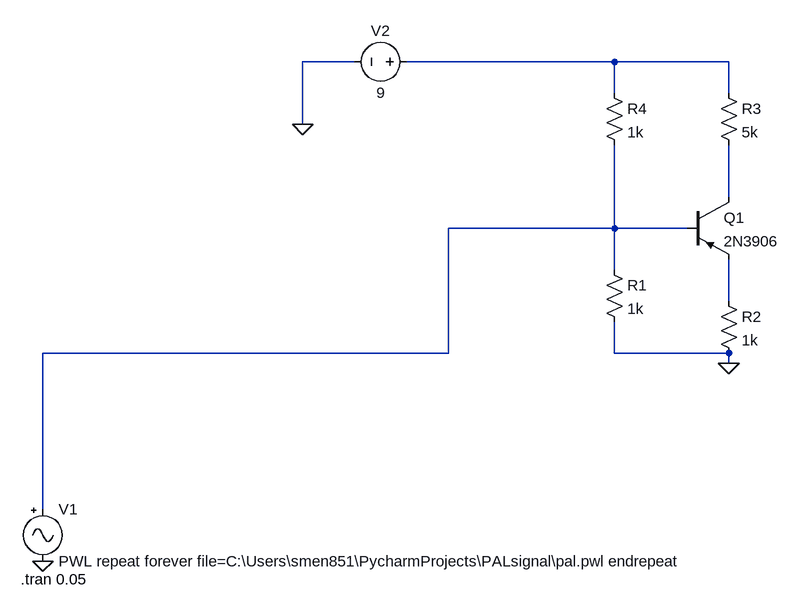
[diagram p0: schematic ltspicesym.asc]
ltspicesym.asc, the LTspice schematic file:
Version 4
SHEET 1 1300 680
WIRE 560 -560 480 -560
WIRE 960 -560 640 -560
WIRE 1136 -560 960 -560
WIRE 960 -512 960 -560
WIRE 1136 -512 1136 -560
WIRE 480 -464 480 -560
WIRE 1136 -352 1136 -432
WIRE 960 -304 960 -432
WIRE 960 -304 704 -304
WIRE 1072 -304 960 -304
WIRE 960 -240 960 -304
WIRE 1136 -192 1136 -256
WIRE 704 -112 704 -304
WIRE 704 -112 80 -112
WIRE 960 -112 960 -160
WIRE 1136 -112 960 -112
WIRE 1136 -96 1136 -112
WIRE 80 128 80 -112
FLAG 80 208 0
FLAG 480 -464 0
FLAG 1136 -96 0
SYMBOL Misc\\signal 80 112 R0
WINDOW 123 0 0 Left 0
WINDOW 39 0 0 Left 0
SYMATTR InstName V1
SYMATTR Value PWL repeat forever file=C:\Users\smen851\PycharmProjects\PALsignal\pal.pwl endrepeat
SYMBOL res 1120 -208 R0
SYMATTR InstName R2
SYMATTR Value 1k
SYMBOL res 1120 -528 R0
SYMATTR InstName R3
SYMATTR Value 5k
SYMBOL voltage 656 -560 R90
WINDOW 0 -32 56 VBottom 2
WINDOW 3 32 56 VTop 2
WINDOW 123 0 0 Left 0
WINDOW 39 0 0 Left 0
SYMATTR InstName V2
SYMATTR Value 9
SYMBOL res 944 -528 R0
SYMATTR InstName R4
SYMATTR Value 1k
SYMBOL pnp 1072 -352 R0
SYMATTR InstName Q1
SYMATTR Value 2N3906
SYMBOL res 944 -256 R0
SYMATTR InstName R1
SYMATTR Value 1k
TEXT 46 236 Left 2 !.tran 0.05

The netlist it stands for:
* ltspicesym.asc
V1 N003 0 PWL repeat forever file=C:\Users\smen851\PycharmProjects\PALsignal\pal.pwl endrepeat
R2 N004 0 1k
R3 N001 N002 5k
V2 N001 0 9
R4 N001 N003 1k
Q1 N002 N003 N004 0 2N3906
R1 N003 0 1k
.model NPN NPN
.model PNP PNP
.lib standard.bjt
.tran 0.05
.backanno
.end